# EAGLE design bozina (EAGLE 9.6.2)
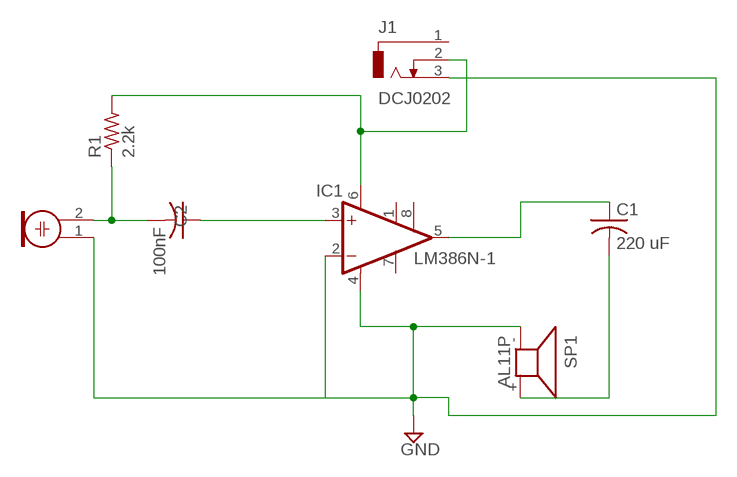
[diagram p0: schematic, sheet 1]

## Parts
C1  220 uF  C-US025-024X044  [C025-024X044]
C2  100nF  C-US025-024X044  [C025-024X044]
IC1  LM386N-1  [DIL08]
J1  DCJ0202  [DCJ0202]
M1  ELECTRET_MICROPHON-F6050AP  [F6050AP]
R1  2.2k  R-US_0204/5  [0204/5]
SP1  AL11P  [AL11P]

## Nets
GND: IC1.2(-IN) IC1.4(GND) J1.3 M1.1 SP1.-
N$1: IC1.6(VS) J1.2 R1.2
N$2: C1.2 SP1.+
N$3: C1.1 IC1.5(OUT)
N$4: C2.2 M1.2 R1.1
N$5: C2.1 IC1.3(+IN)
Unconnected: IC1.1(GAIN) IC1.7(BYPASS) IC1.8(GAIN) J1.1

## Library data of the parts
C1 C2 = rcl:C-US: CAPACITOR, American symbol; SPICEPREFIX: C
IC1 = linear:LM386?-*: Low Voltage Audio Power Amplifier Source: http://cache.national.com/ds/LM/LM386.pdf
J1 = con-jack:DCJ0202: DC POWER JACK Source: DCJ0202.pdf; OC_FARNELL: unknown; OC_NEWARK: unknown
M1 = microphon:ELECTRET_MICROPHON-: Electret Condenser Microphone
R1 = rcl:R-US_: RESISTOR, American symbol; SPICEPREFIX: 2.2k
SP1 = buzzer:AL11P: SPEAKER Source: Buerklin; OC_FARNELL: unknown; OC_NEWARK: unknown

## Board
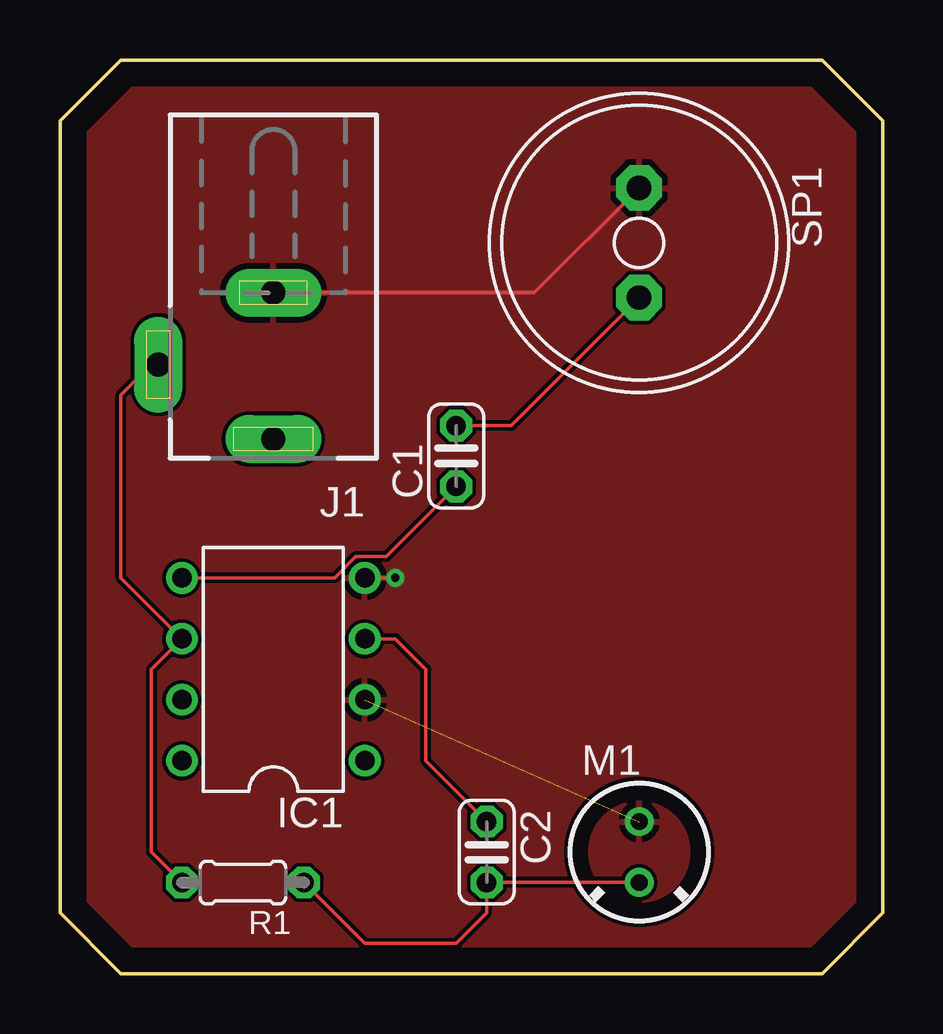
[diagram p1: board, top side]
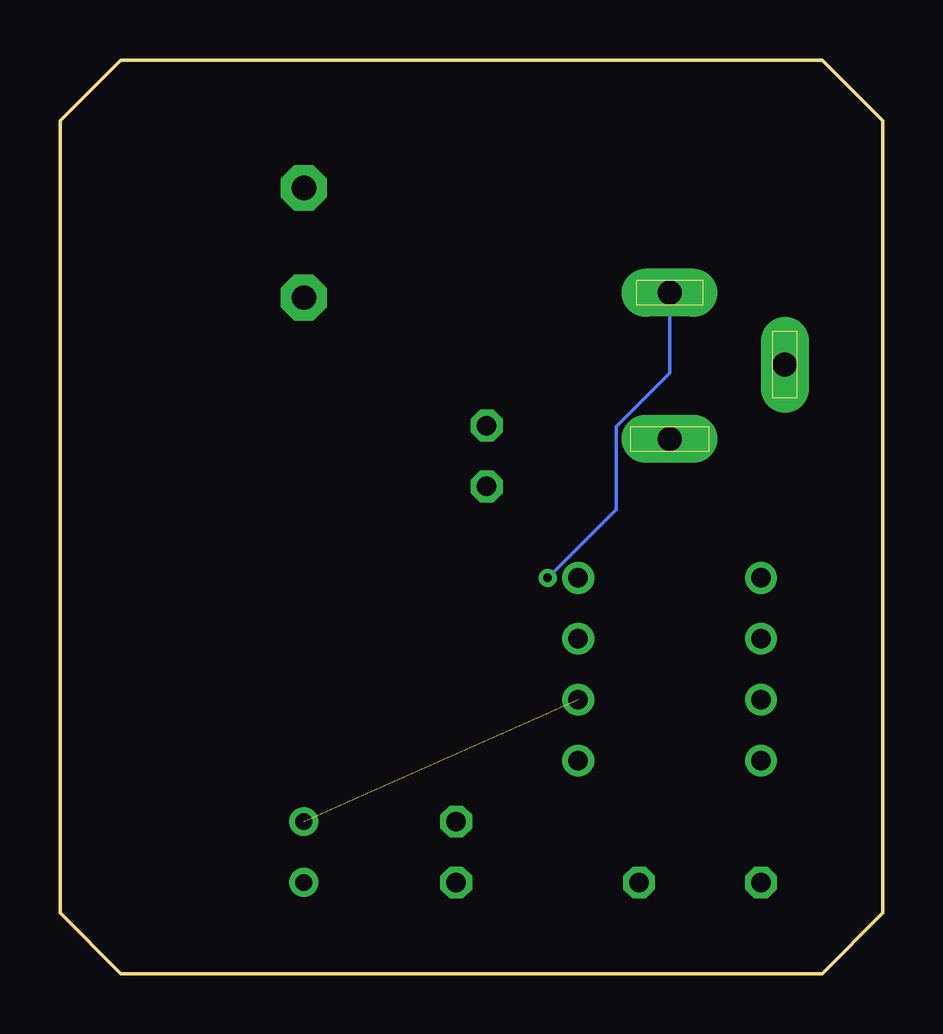
[diagram p2: board, bottom side, seen from below]

Size 34.29 x 38.1 mm. Coordinates in mm from the lower left corner, seen from the top.
Outline: 2.54,0 31.75,0 34.29,2.54 34.29,35.56 31.75,38.1 2.54,38.1 0,35.56 0,2.54 2.54,0
Copper layers (1*16): Top 0.035mm / dielectric 1.5mm / Bottom 0.035mm
Design rules "default": minimum track width 6mil, minimum drill 0.35mm, track to track 6mil, track to pad 6mil, pad to pad 6mil, via to via 6mil, smd to smd 6mil, copper to edge 40mil, drill to drill 6mil, minimum pad ring 10mil, minimum via ring 8mil, stop-mask expansion 4mil, vias tented up to drill 0mil, thermal gap 10mil

### Footprints (pad centres in the part's own frame; a part is rotated, then mirrored left to right if it is on the bottom)
C025-024X044 = drill 0.813 octagon: 1 -1.27,0; 2 1.27,0
DIL08 = drill 0.813 pad 1.27: 1 -3.81,-3.81; 2 -1.27,-3.81; 3 1.27,-3.81; 4 3.81,-3.81; 5 3.81,3.81; 6 1.27,3.81; 7 -1.27,3.81; 8 -3.81,3.81
DCJ0202 = drill 1 pad 2 long: 1 0,3.1; 2 4.8,0; 3 0,-3
F6050AP = drill 0.7 pad 1.2: 1 0,1.27; 2 0,-1.27
0204/5 = drill 0.813 octagon: 1 -2.54,0; 2 2.54,0
AL11P = drill 1.016 pad 1.905 octagon: + 2.286,0; - -2.286,0

### Placement (x,y rotation side)
C1  16.51,21.59 90 top
C2  17.78,5.08 270 top
IC1  8.89,12.7 90 top
J1  8.89,25.4 180 top
M1  24.13,5.08 0 top
R1  7.62,3.81 180 top
SP1  24.13,30.48 270 top

### Tracks (layer width: path | path; a pad name or v marks a point on that pad's centre or on a via)
GND  (via drill 0.35)  (1 unrouted)
  Top 0.152: J1.3 19.76,28.4 SP1.- | IC1.4 v13.97,16.51
  Bottom 0.152: v13.97,16.51 11.12,19.36 11.12,22.81 8.89,25.04 J1.3
  pour Top: -1.27,35.56 2.54,39.37 31.75,39.37 35.56,35.56 35.56,2.54 34.29,1.27 31.75,-1.27 2.54,-1.27 -1.27,2.54
N$1
  Top 0.152: J1.2 3.81,25.4 2.54,24.13 2.54,16.51 IC1.6 3.81,12.7 3.81,5.08 R1.2
N$2
  Top 0.152: SP1.+ 18.8,22.86 C1.2
N$3
  Top 0.152: C1.1 13.59,17.4 12.33,17.4 11.44,16.51 IC1.5
N$4
  Top 0.152: R1.1 12.7,1.27 16.51,1.27 17.78,2.54 C2.2 M1.2
N$5
  Top 0.152: C2.1 15.24,8.89 15.24,12.7 13.97,13.97 IC1.3